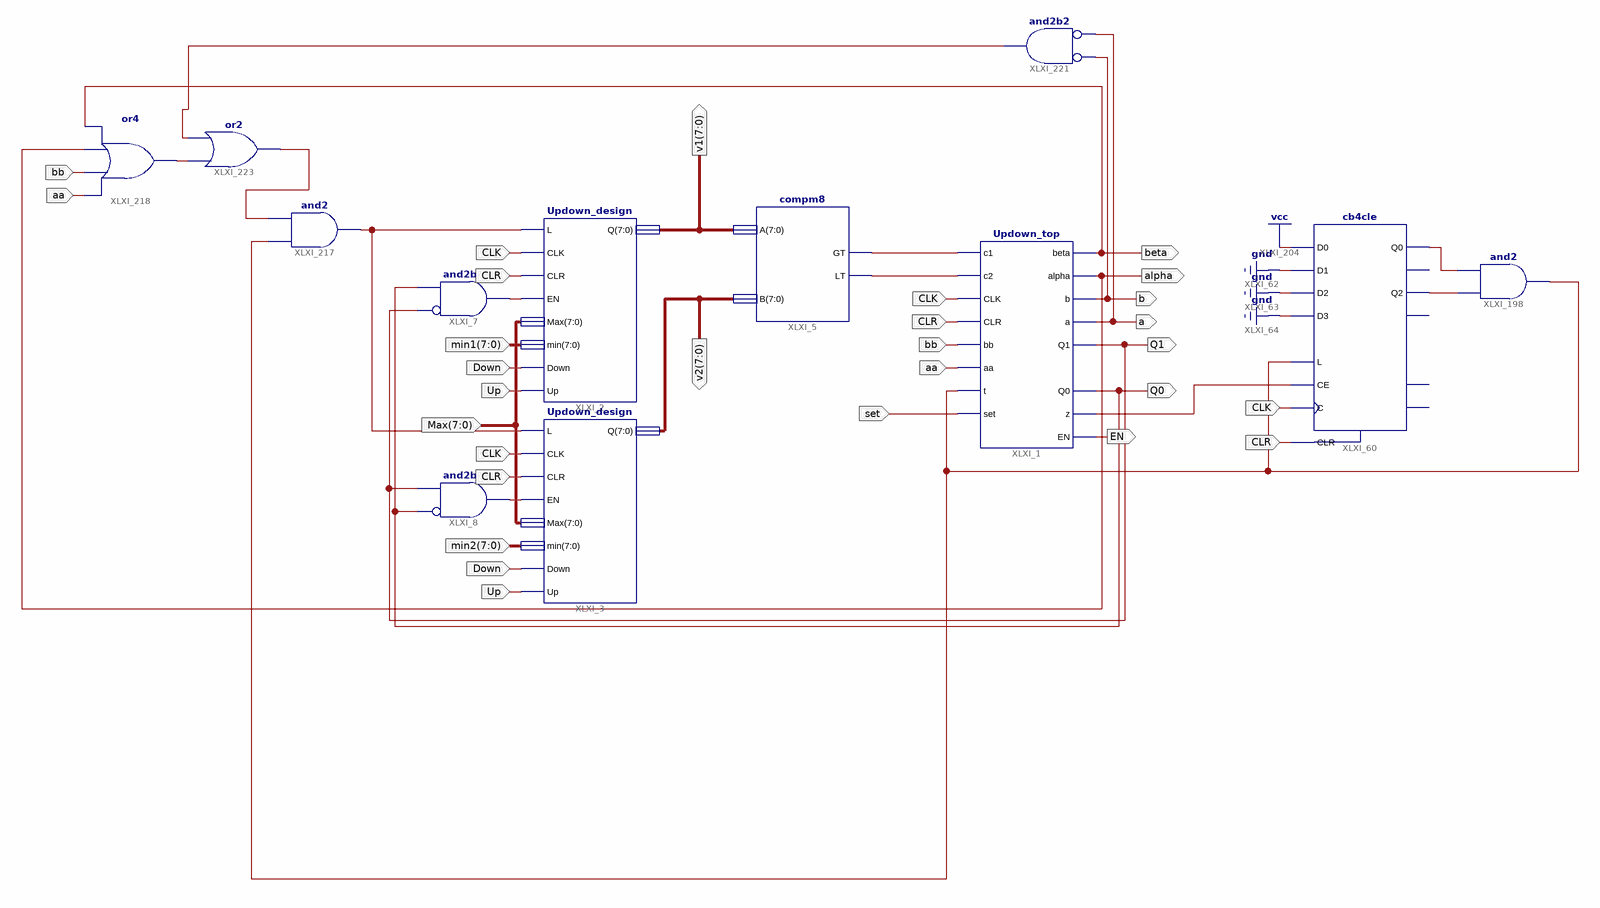
[diagram p0: schematic sheet 1]
// Xilinx ISE schematic updown_top_top.sch (spartan3) as structural Verilog: 12 symbols, 19 ports
module updown_top_top (
  input  CLK,
  input  CLR,
  input  [7:0] min1,
  input  Up,
  input  bb,
  input  aa,
  input  [7:0] min2,
  input  [7:0] Max,
  input  set,
  input  Down,
  output [7:0] v1,
  output [7:0] v2,
  output Q1,
  output Q0,
  output beta,
  output alpha,
  output b,
  output a,
  output EN
);

  wire t0, t2, XLXN_9, XLXN_10, XLXN_11, XLXN_12, XLXN_80, XLXN_81, XLXN_110, XLXN_137, XLXN_138, XLXN_139;

  Updown_top XLXI_1 (
    .c1(XLXN_11), .c2(XLXN_12), .CLK(CLK), .CLR(CLR), .bb(bb), .aa(aa), .t(XLXN_81), .set(set), .beta(beta),
    .alpha(alpha), .b(b), .a(a), .Q1(Q1), .Q0(Q0), .z(XLXN_80), .EN(EN));
  Updown_design XLXI_3 (
    .L(XLXN_110), .CLK(CLK), .CLR(CLR), .EN(XLXN_10), .Max(Max), .min(min2), .Down(Down), .Up(Up), .Q(v2));
  compm8 XLXI_5 (.A(v1), .B(v2), .GT(XLXN_11), .LT(XLXN_12));
  and XLXI_7 (XLXN_9, ~Q1, Q0);  // and2b1
  and XLXI_8 (XLXN_10, ~Q0, Q1);  // and2b1
  and XLXI_198 (XLXN_81, t2, t0);
  cb4cle XLXI_60 (
    .C(CLK), .CE(XLXN_80), .CLR(CLR), .D0(1'b1), .D1(1'b0), .D2(1'b0), .D3(1'b0), .L(XLXN_81), .Q0(t0),
    .Q2(t2));  // open: CEO, Q1, Q3, TC
  and XLXI_217 (XLXN_110, XLXN_81, XLXN_139);
  Updown_design XLXI_2 (
    .L(XLXN_110), .CLK(CLK), .CLR(CLR), .EN(XLXN_9), .Max(Max), .min(min1), .Down(Down), .Up(Up), .Q(v1));
  and XLXI_221 (XLXN_138, ~b, ~a);  // and2b2
  or XLXI_218 (XLXN_137, aa, bb, alpha, beta);
  or XLXI_223 (XLXN_139, XLXN_137, XLXN_138);
endmodule
